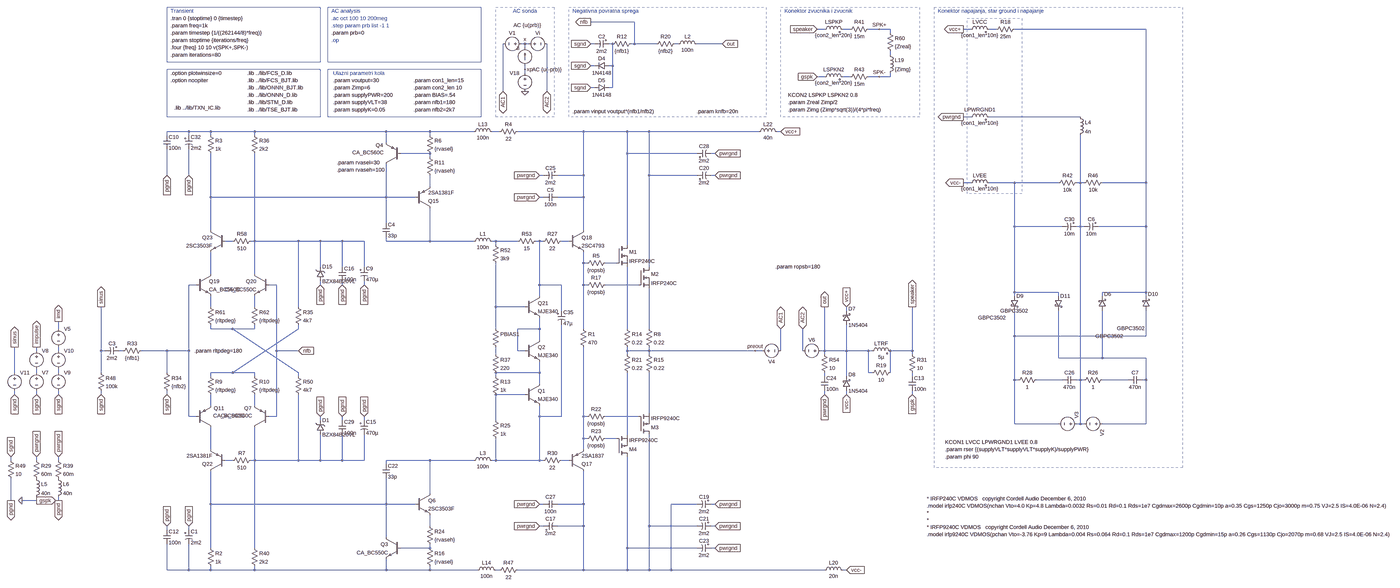
[diagram p0: schematic pab3bbb-impulse.asc, whole sheet]
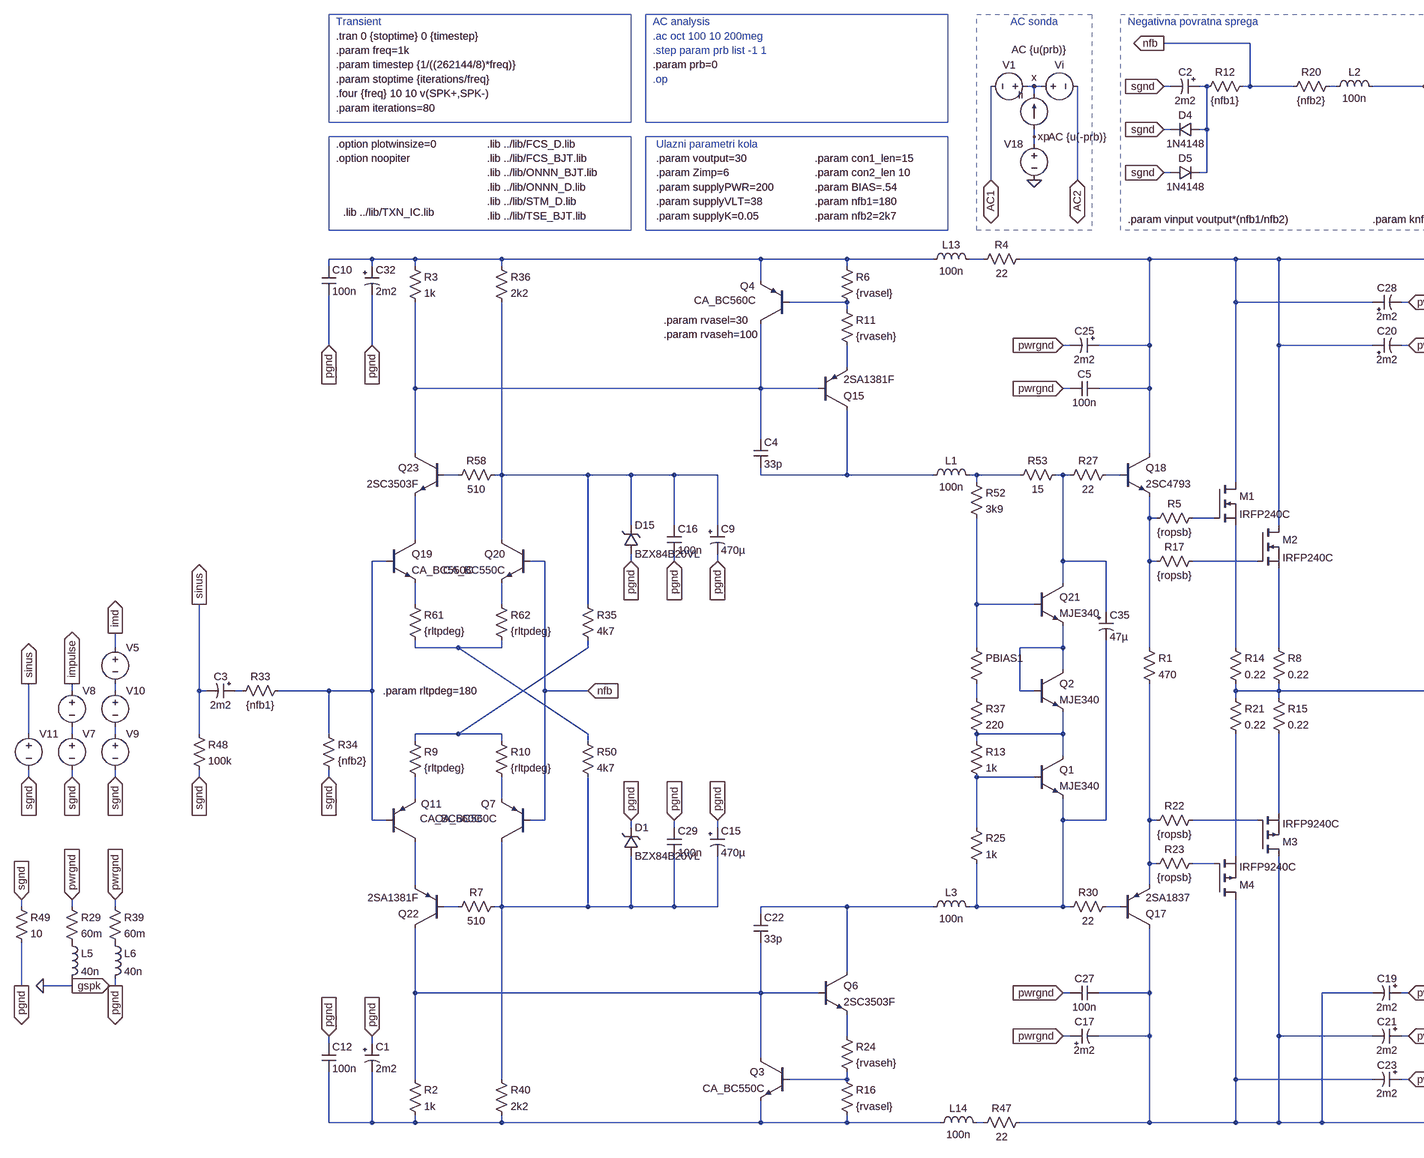
[diagram p1: schematic pab3bbb-impulse.asc, part, row 1 of 1, column 1 of 2]
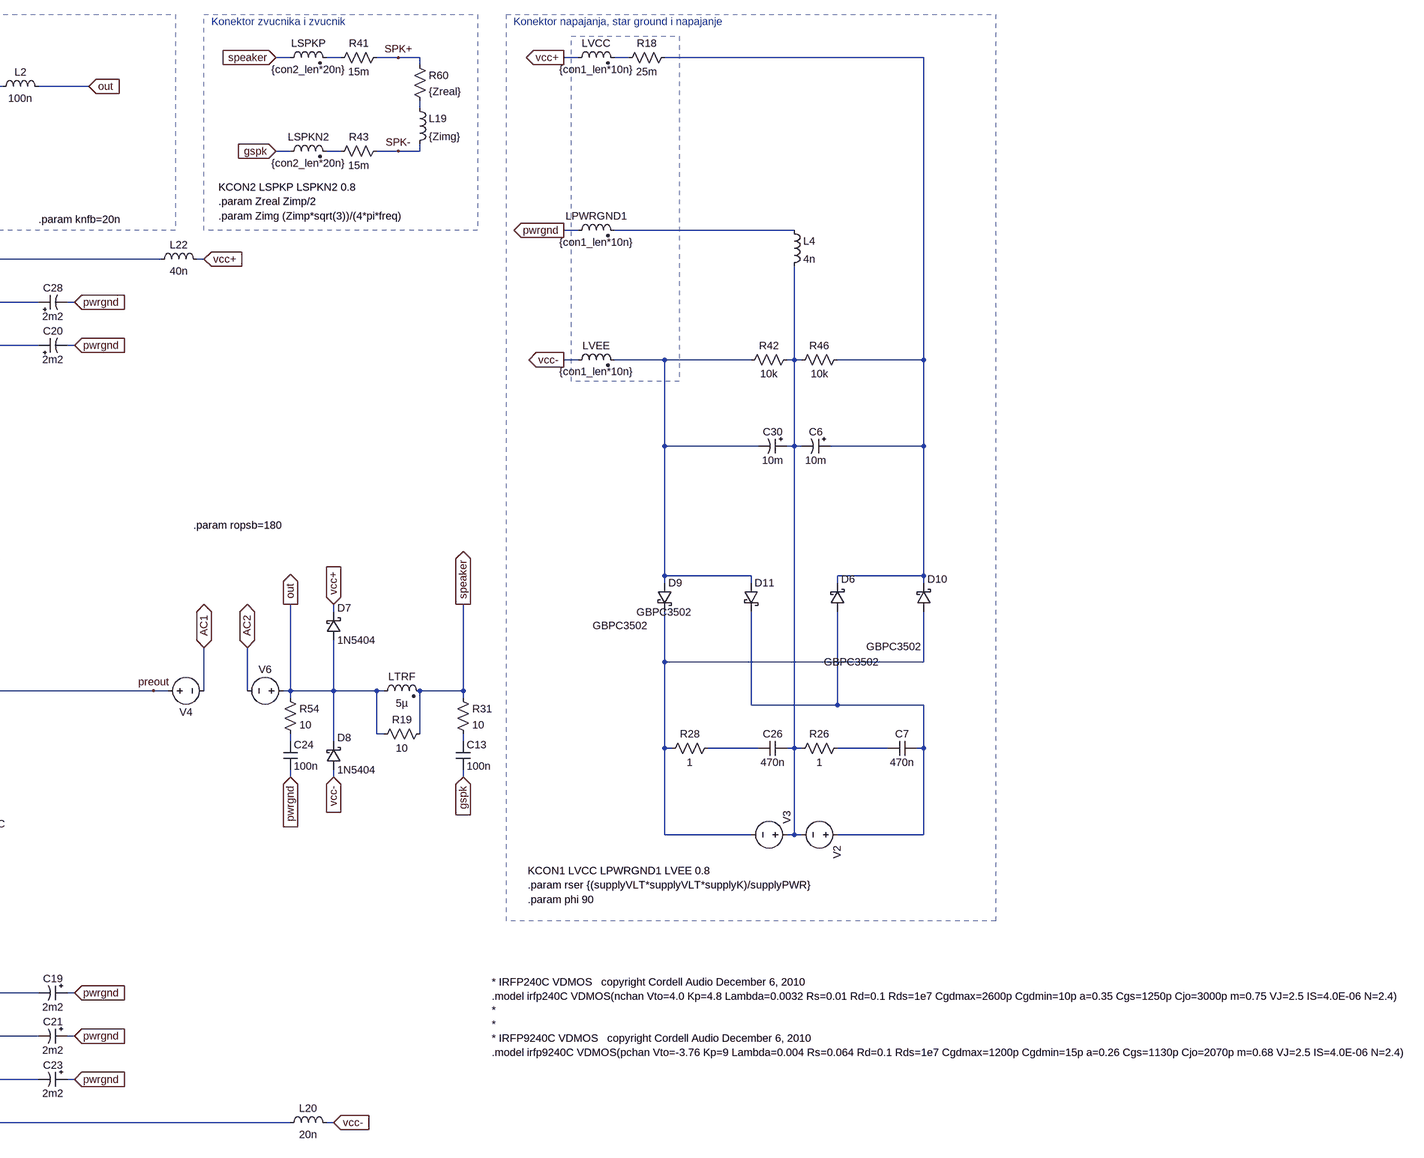
[diagram p2: schematic pab3bbb-impulse.asc, part, row 1 of 1, column 2 of 2]
pab3bbb-impulse.asc, the LTspice schematic file:
Version 4
SHEET 1 6124 2336
WIRE 1472 -1568 1280 -1568
WIRE 2304 -1536 2272 -1536
WIRE 2416 -1536 2384 -1536
WIRE 2544 -1536 2496 -1536
WIRE 2592 -1536 2544 -1536
WIRE 2944 -1536 2912 -1536
WIRE 3056 -1536 3024 -1536
WIRE 3712 -1536 3136 -1536
WIRE 2592 -1520 2592 -1536
WIRE 992 -1472 976 -1472
WIRE 1008 -1472 992 -1472
WIRE 1296 -1472 1280 -1472
WIRE 1376 -1472 1360 -1472
WIRE 1472 -1472 1472 -1568
WIRE 1472 -1472 1456 -1472
WIRE 1568 -1472 1472 -1472
WIRE 1664 -1472 1648 -1472
WIRE 1856 -1472 1744 -1472
WIRE 992 -1456 992 -1472
WIRE 2592 -1424 2592 -1440
WIRE 1296 -1376 1280 -1376
WIRE 1376 -1376 1376 -1472
WIRE 1376 -1376 1360 -1376
WIRE 992 -1360 992 -1376
WIRE 992 -1344 992 -1360
WIRE 2304 -1328 2272 -1328
WIRE 2416 -1328 2384 -1328
WIRE 2544 -1328 2496 -1328
WIRE 2592 -1328 2592 -1344
WIRE 2592 -1328 2544 -1328
WIRE 1296 -1280 1280 -1280
WIRE 1376 -1280 1376 -1376
WIRE 1376 -1280 1360 -1280
WIRE 896 -1264 896 -1472
WIRE 1088 -1264 1088 -1472
WIRE 2944 -1152 2912 -1152
WIRE 3424 -1152 3024 -1152
WIRE -480 -1088 -576 -1088
WIRE -384 -1088 -480 -1088
WIRE -192 -1088 -384 -1088
WIRE 384 -1088 -192 -1088
WIRE 576 -1088 384 -1088
WIRE 768 -1088 576 -1088
WIRE 880 -1088 848 -1088
WIRE 1248 -1088 960 -1088
WIRE 1440 -1088 1248 -1088
WIRE 1536 -1088 1440 -1088
WIRE 2016 -1088 1536 -1088
WIRE 2112 -1088 2096 -1088
WIRE -576 -1072 -576 -1088
WIRE -480 -1072 -480 -1088
WIRE -384 -1072 -384 -1088
WIRE -192 -1072 -192 -1088
WIRE 576 -1072 576 -1088
WIRE 384 -1040 384 -1088
WIRE 576 -992 448 -992
WIRE 1440 -992 1440 -1088
WIRE 1744 -992 1440 -992
WIRE 1824 -992 1808 -992
WIRE 576 -976 576 -992
WIRE -576 -896 -576 -1008
WIRE -480 -896 -480 -1008
WIRE 1072 -896 1056 -896
WIRE 1248 -896 1248 -1088
WIRE 1248 -896 1136 -896
WIRE 1536 -896 1536 -1088
WIRE 1744 -896 1536 -896
WIRE 1824 -896 1808 -896
WIRE 2944 -864 2912 -864
WIRE 3136 -864 3024 -864
WIRE 3328 -864 3136 -864
WIRE 3424 -864 3424 -1072
WIRE 3424 -864 3408 -864
WIRE 3440 -864 3424 -864
WIRE 3712 -864 3712 -1536
WIRE 3712 -864 3520 -864
WIRE 576 -848 576 -896
WIRE -384 -800 -384 -992
WIRE 384 -800 384 -944
WIRE 384 -800 -384 -800
WIRE 512 -800 384 -800
WIRE 1072 -800 1056 -800
WIRE 1248 -800 1248 -896
WIRE 1248 -800 1136 -800
WIRE 384 -688 384 -800
WIRE 3136 -672 3136 -864
WIRE 3344 -672 3136 -672
WIRE 3424 -672 3424 -864
WIRE 3424 -672 3408 -672
WIRE 3440 -672 3424 -672
WIRE 3712 -672 3712 -864
WIRE 3712 -672 3504 -672
WIRE -384 -656 -384 -800
WIRE 1248 -656 1248 -800
WIRE -288 -608 -320 -608
WIRE -192 -608 -192 -992
WIRE -192 -608 -208 -608
WIRE 0 -608 -192 -608
WIRE 96 -608 0 -608
WIRE 192 -608 96 -608
WIRE 288 -608 192 -608
WIRE 384 -608 384 -624
WIRE 576 -608 576 -752
WIRE 576 -608 384 -608
WIRE 768 -608 576 -608
WIRE 864 -608 848 -608
WIRE 960 -608 864 -608
WIRE 1056 -608 1040 -608
WIRE 1072 -608 1056 -608
WIRE 1184 -608 1152 -608
WIRE 864 -592 864 -608
WIRE 1440 -592 1440 -992
WIRE 1248 -512 1248 -560
WIRE 1264 -512 1248 -512
WIRE 1392 -512 1344 -512
WIRE 96 -496 96 -608
WIRE 192 -496 192 -608
WIRE 288 -496 288 -608
WIRE 1536 -496 1536 -896
WIRE -384 -464 -384 -560
WIRE -192 -464 -192 -608
WIRE -448 -416 -480 -416
WIRE -96 -416 -128 -416
WIRE 96 -416 96 -432
WIRE 192 -416 192 -432
WIRE 288 -416 288 -432
WIRE 1056 -416 1056 -608
WIRE 1152 -416 1056 -416
WIRE 1248 -416 1248 -512
WIRE 1264 -416 1248 -416
WIRE 1488 -416 1344 -416
WIRE 3136 -384 3136 -672
WIRE 3328 -384 3136 -384
WIRE 3712 -384 3712 -672
WIRE 3712 -384 3520 -384
WIRE 1056 -368 1056 -416
WIRE 3136 -368 3136 -384
WIRE 3328 -368 3328 -384
WIRE 3520 -368 3520 -384
WIRE 3712 -368 3712 -384
WIRE -384 -320 -384 -368
WIRE -192 -320 -192 -368
WIRE 0 -320 0 -608
WIRE 864 -320 864 -512
WIRE 992 -320 864 -320
WIRE 1152 -304 1152 -416
WIRE 2400 -304 2400 -320
WIRE -1056 -224 -1056 -256
WIRE -384 -224 -384 -240
WIRE -288 -224 -384 -224
WIRE -192 -224 -192 -240
WIRE -192 -224 -288 -224
WIRE 0 -224 0 -240
WIRE 864 -224 864 -320
WIRE 1056 -224 1056 -272
WIRE 1056 -224 960 -224
WIRE 1248 -224 1248 -416
WIRE 1440 -224 1440 -496
WIRE 1536 -224 1536 -400
WIRE 3136 -192 3136 -304
WIRE 3712 -192 3712 -304
WIRE 3712 -192 3136 -192
WIRE 1056 -176 1056 -224
WIRE -1152 -128 -1152 -144
WIRE -1056 -128 -1056 -144
WIRE -864 -128 -864 -320
WIRE -848 -128 -864 -128
WIRE -768 -128 -784 -128
WIRE -576 -128 -688 -128
WIRE -480 -128 -480 -416
WIRE -480 -128 -576 -128
WIRE -96 -128 -96 -416
WIRE 0 -128 -96 -128
WIRE 960 -128 960 -224
WIRE 992 -128 960 -128
WIRE 1440 -128 1440 -144
WIRE 1536 -128 1536 -144
WIRE 1536 -128 1440 -128
WIRE 2000 -128 1536 -128
WIRE 2032 -128 2000 -128
WIRE 2112 -128 2112 -224
WIRE 2208 -128 2208 -224
WIRE 2304 -128 2304 -320
WIRE 2304 -128 2288 -128
WIRE 2400 -128 2400 -240
WIRE 2400 -128 2304 -128
WIRE 2496 -128 2400 -128
WIRE 2512 -128 2496 -128
WIRE 2688 -128 2688 -320
WIRE 2688 -128 2592 -128
WIRE 864 -112 864 -144
WIRE 1440 -112 1440 -128
WIRE 1536 -112 1536 -128
WIRE 2304 -112 2304 -128
WIRE 2688 -112 2688 -128
WIRE 3328 -96 3328 -304
WIRE 3520 -96 3520 -304
WIRE 3520 -96 3328 -96
WIRE 3712 -96 3520 -96
WIRE -1248 -32 -1248 -144
WIRE -1152 -32 -1152 -48
WIRE -1056 -32 -1056 -48
WIRE -864 -32 -864 -128
WIRE -576 -32 -576 -128
WIRE -288 -32 0 -224
WIRE -288 -32 -384 -32
WIRE -192 -32 -288 -32
WIRE 0 -32 -288 -224
WIRE 1056 -32 1056 -80
WIRE 1056 -32 864 -32
WIRE 2496 -32 2496 -128
WIRE 2512 -32 2496 -32
WIRE 2592 -32 2592 -128
WIRE -384 -16 -384 -32
WIRE -192 -16 -192 -32
WIRE 0 -16 0 -32
WIRE 864 -16 864 -32
WIRE 2304 -16 2304 -32
WIRE 2400 -16 2400 -128
WIRE 2688 -16 2688 -32
WIRE 3136 0 3136 -192
WIRE 3152 0 3136 0
WIRE 3344 0 3232 0
WIRE 3424 0 3424 -672
WIRE 3424 0 3408 0
WIRE 3440 0 3424 0
WIRE 3632 0 3520 0
WIRE 3712 0 3712 -96
WIRE 3712 0 3696 0
WIRE 1056 16 1056 -32
WIRE -1248 64 -1248 48
WIRE -1152 64 -1152 48
WIRE -1056 64 -1056 48
WIRE -864 64 -864 48
WIRE -576 64 -576 48
WIRE 992 64 864 64
WIRE 2304 64 2304 48
WIRE 2400 64 2400 48
WIRE 2688 64 2688 48
WIRE -384 112 -384 64
WIRE -192 112 -192 64
WIRE 1536 144 1536 -32
WIRE -480 160 -480 -128
WIRE -448 160 -480 160
WIRE -96 160 -96 -128
WIRE -96 160 -128 160
WIRE 1056 160 1056 112
WIRE 1152 160 1152 -240
WIRE 1152 160 1056 160
WIRE 1248 160 1248 -144
WIRE 1264 160 1248 160
WIRE 1488 160 1344 160
WIRE 96 176 96 160
WIRE 192 176 192 160
WIRE 288 176 288 160
WIRE 864 176 864 64
WIRE 3136 192 3136 0
WIRE 3328 192 3136 192
WIRE 3424 192 3424 0
WIRE 3424 192 3408 192
WIRE 3440 192 3424 192
WIRE 3712 192 3712 0
WIRE 3712 192 3520 192
WIRE 1440 240 1440 -32
WIRE 1248 256 1248 160
WIRE 1264 256 1248 256
WIRE 1392 256 1344 256
WIRE -384 304 -384 208
WIRE 1248 304 1248 256
WIRE -1264 352 -1264 336
WIRE -1152 352 -1152 336
WIRE -1056 352 -1056 336
WIRE -288 352 -320 352
WIRE -192 352 -192 208
WIRE -192 352 -208 352
WIRE 0 352 0 64
WIRE 0 352 -192 352
WIRE 96 352 96 240
WIRE 96 352 0 352
WIRE 192 352 192 240
WIRE 192 352 96 352
WIRE 288 352 288 240
WIRE 288 352 192 352
WIRE 576 352 384 352
WIRE 768 352 576 352
WIRE 864 352 864 256
WIRE 864 352 848 352
WIRE 1056 352 1056 160
WIRE 1056 352 864 352
WIRE 1072 352 1056 352
WIRE 1184 352 1152 352
WIRE 384 368 384 352
WIRE 576 496 576 352
WIRE -1264 528 -1264 432
WIRE -1152 528 -1152 512
WIRE -1152 528 -1216 528
WIRE -1056 528 -1056 512
WIRE -384 544 -384 400
WIRE 384 544 384 432
WIRE 384 544 -384 544
WIRE 512 544 384 544
WIRE 1072 544 1056 544
WIRE 1248 544 1248 400
WIRE 1248 544 1136 544
WIRE 1744 544 1632 544
WIRE 1824 544 1808 544
WIRE 576 640 576 592
WIRE 1072 640 1056 640
WIRE 1248 640 1248 544
WIRE 1248 640 1136 640
WIRE 1536 640 1536 240
WIRE 1744 640 1536 640
WIRE 1824 640 1808 640
WIRE -576 656 -576 640
WIRE -480 656 -480 640
WIRE 384 688 384 544
WIRE -384 736 -384 544
WIRE -192 736 -192 352
WIRE 576 736 576 720
WIRE 576 736 448 736
WIRE 1440 736 1440 336
WIRE 1744 736 1440 736
WIRE 1824 736 1808 736
WIRE -576 832 -576 720
WIRE -480 832 -480 720
WIRE -480 832 -576 832
WIRE -384 832 -384 816
WIRE -384 832 -480 832
WIRE -192 832 -192 816
WIRE -192 832 -384 832
WIRE 384 832 384 784
WIRE 384 832 -192 832
WIRE 576 832 576 816
WIRE 576 832 384 832
WIRE 784 832 576 832
WIRE 880 832 864 832
WIRE 1248 832 1248 640
WIRE 1248 832 960 832
WIRE 1440 832 1440 736
WIRE 1440 832 1248 832
WIRE 1536 832 1536 640
WIRE 1536 832 1440 832
WIRE 1632 832 1632 544
WIRE 1632 832 1536 832
WIRE 2304 832 1632 832
WIRE 2400 832 2384 832
FLAG 2112 -1088 vcc+
IOPIN 2112 -1088 In
FLAG 992 -1472 x
FLAG 2400 832 vcc-
IOPIN 2400 832 In
FLAG 2304 -320 out
IOPIN 2304 -320 Out
FLAG 1280 -1568 nfb
IOPIN 1280 -1568 Out
FLAG 0 -128 nfb
IOPIN 0 -128 In
FLAG 992 -1360 xp
FLAG 2304 64 pwrgnd
IOPIN 2304 64 In
FLAG -576 64 sgnd
IOPIN -576 64 In
FLAG 1280 -1472 sgnd
IOPIN 1280 -1472 In
FLAG -1248 64 sgnd
IOPIN -1248 64 In
FLAG -1248 -144 sinus
IOPIN -1248 -144 Out
FLAG 2912 -1536 vcc+
IOPIN 2912 -1536 Out
FLAG 2912 -864 vcc-
IOPIN 2912 -864 Out
FLAG 1856 -1472 out
IOPIN 1856 -1472 In
FLAG 2688 -320 speaker
IOPIN 2688 -320 Out
FLAG 2272 -1536 speaker
IOPIN 2272 -1536 In
FLAG 2912 -1152 pwrgnd
IOPIN 2912 -1152 Out
FLAG -1152 -144 impulse
IOPIN -1152 -144 Out
FLAG 896 -1264 AC1
IOPIN 896 -1264 BiDir
FLAG 1088 -1264 AC2
IOPIN 1088 -1264 BiDir
FLAG 2112 -224 AC1
IOPIN 2112 -224 BiDir
FLAG 2208 -224 AC2
IOPIN 2208 -224 BiDir
FLAG 2544 -1536 SPK+
FLAG 2544 -1328 SPK-
FLAG -1056 -256 imd
IOPIN -1056 -256 Out
FLAG 2400 -320 vcc+
IOPIN 2400 -320 In
FLAG 2400 64 vcc-
IOPIN 2400 64 In
FLAG -1152 64 sgnd
IOPIN -1152 64 In
FLAG -1056 64 sgnd
IOPIN -1056 64 In
FLAG 1056 640 pwrgnd
IOPIN 1056 640 In
FLAG -864 64 sgnd
IOPIN -864 64 In
FLAG -1264 336 sgnd
IOPIN -1264 336 In
FLAG 2000 -128 preout
FLAG 1280 -1376 sgnd
IOPIN 1280 -1376 In
FLAG 1280 -1280 sgnd
IOPIN 1280 -1280 In
FLAG 1056 -800 pwrgnd
IOPIN 1056 -800 In
FLAG 1056 544 pwrgnd
IOPIN 1056 544 In
FLAG -480 640 pgnd
IOPIN -480 640 In
FLAG -576 640 pgnd
IOPIN -576 640 In
FLAG 2688 64 gspk
IOPIN 2688 64 In
FLAG -1056 528 pgnd
IOPIN -1056 528 Out
FLAG -1056 336 pwrgnd
IOPIN -1056 336 In
FLAG 2272 -1328 gspk
IOPIN 2272 -1328 In
FLAG -1152 528 gspk
IOPIN -1152 528 Out
FLAG -1152 336 pwrgnd
IOPIN -1152 336 In
FLAG -1264 528 pgnd
IOPIN -1264 528 Out
FLAG 96 160 pgnd
IOPIN 96 160 In
FLAG 288 160 pgnd
IOPIN 288 160 In
FLAG 1824 544 pwrgnd
IOPIN 1824 544 In
FLAG 1824 640 pwrgnd
IOPIN 1824 640 In
FLAG 1824 736 pwrgnd
IOPIN 1824 736 In
FLAG 1056 -896 pwrgnd
IOPIN 1056 -896 In
FLAG 1824 -896 pwrgnd
IOPIN 1824 -896 In
FLAG 1824 -992 pwrgnd
IOPIN 1824 -992 In
FLAG 96 -416 pgnd
IOPIN 96 -416 In
FLAG 288 -416 pgnd
IOPIN 288 -416 In
FLAG -480 -896 pgnd
IOPIN -480 -896 In
FLAG -576 -896 pgnd
IOPIN -576 -896 In
FLAG 992 -1264 0
FLAG -1216 528 0
FLAG 192 -416 pgnd
IOPIN 192 -416 In
FLAG 192 160 pgnd
IOPIN 192 160 In
FLAG -864 -320 sinus
IOPIN -864 -320 Out
DATAFLAG 1344 -1088 ""
DATAFLAG 1344 832 ""
DATAFLAG 1248 -992 "Ic(Q18)"
DATAFLAG 1824 -128 ""
DATAFLAG 1440 -896 "Id(M1)"
SYMBOL res 1472 -1488 R90
WINDOW 0 0 56 VBottom 2
WINDOW 3 32 56 VTop 2
SYMATTR InstName R12
SYMATTR Value {nfb1}
SYMBOL voltage 3536 192 R90
WINDOW 123 0 0 Left 2
WINDOW 3 -94 177 Invisible 2
SYMATTR Value SINE(0 {supplyVLT*sqrt(2)} 50 1m 0 {phi})
SYMATTR SpiceLine Rser={rser}
SYMATTR InstName V2
SYMBOL current 992 -1376 R180
WINDOW 0 24 77 Left 2
WINDOW 3 24 0 Invisible 2
WINDOW 123 -71 178 Left 2
WINDOW 39 0 0 Left 2
SYMATTR InstName Ii
SYMATTR Value 0
SYMATTR Value2 AC {u(prb)}
SYMBOL voltage 992 -1472 R270
WINDOW 0 32 56 VTop 2
WINDOW 3 -32 56 Invisible 2
WINDOW 123 -97 96 VBottom 2
WINDOW 39 -32 56 VBottom 2
SYMATTR InstName Vi
SYMATTR Value 0
SYMATTR Value2 AC {u(-prb)}
SYMBOL pnp -448 208 M180
WINDOW 0 77 84 Left 2
WINDOW 3 75 52 Left 2
SYMATTR InstName Q11
SYMATTR Value CA_BC560C
SYMBOL res -784 -112 R270
WINDOW 0 32 56 VTop 2
WINDOW 3 0 56 VBottom 2
SYMATTR InstName R33
SYMATTR Value {nfb1}
SYMBOL res -592 -48 R0
SYMATTR InstName R34
SYMATTR Value {nfb2}
SYMBOL res -400 -32 R0
SYMATTR InstName R9
SYMATTR Value {rltpdeg}
SYMBOL schottky 2384 -240 M180
WINDOW 0 24 72 Left 2
WINDOW 3 24 0 Left 2
SYMATTR InstName D7
SYMATTR Value 1N5404
SYMATTR Description Diode
SYMATTR Type diode
SYMBOL schottky 2384 48 M180
WINDOW 0 24 72 Left 2
WINDOW 3 24 0 Left 2
SYMATTR InstName D8
SYMATTR Value 1N5404
SYMATTR Description Diode
SYMATTR Type diode
SYMBOL ind2 2496 -112 R270
WINDOW 0 32 56 VTop 2
WINDOW 3 4 56 VBottom 2
SYMATTR InstName LTRF
SYMATTR Value 5µ
SYMATTR SpiceLine Rser=50m Rpar=3meg Cpar=1p
SYMATTR Type ind
SYMBOL res 2496 -16 R270
WINDOW 0 32 56 VTop 2
WINDOW 3 0 56 VBottom 2
SYMATTR InstName R19
SYMATTR Value 10
SYMBOL res 1664 -1488 R90
WINDOW 0 0 56 VBottom 2
WINDOW 3 32 56 VTop 2
SYMATTR InstName R20
SYMATTR Value {nfb2}
SYMBOL voltage 992 -1472 R90
WINDOW 0 -32 56 VBottom 2
WINDOW 3 32 56 Invisible 2
WINDOW 123 0 0 Left 2
WINDOW 39 0 0 Left 2
SYMATTR InstName V1
SYMATTR Value 0
SYMBOL schottky 3504 -304 M180
WINDOW 0 24 72 Left 2
WINDOW 3 -14 -112 Left 2
SYMATTR InstName D6
SYMATTR Value GBPC3502
SYMATTR Description Diode
SYMATTR Type diode
SYMBOL schottky 3120 -368 R0
WINDOW 3 -144 95 Left 2
SYMATTR Value GBPC3502
SYMATTR InstName D9
SYMATTR Description Diode
SYMATTR Type diode
SYMBOL voltage 3424 192 M270
WINDOW 123 0 0 Left 2
WINDOW 3 -96 -62 Invisible 2
SYMATTR Value SINE(0 {supplyVLT*sqrt(2)} 50 1m 0 {phi})
SYMATTR SpiceLine Rser={rser}
SYMATTR InstName V3
SYMBOL res 2288 -128 R0
SYMATTR InstName R54
SYMATTR Value 10
SYMBOL res 2576 -1536 R0
SYMATTR InstName R60
SYMATTR Value {Zreal}
SYMBOL ind 2576 -1440 R0
SYMATTR InstName L19
SYMATTR Value {Zimg}
SYMATTR SpiceLine Cpar=10p
SYMBOL voltage 992 -1360 M0
WINDOW 123 0 0 Left 2
WINDOW 39 0 0 Left 2
WINDOW 3 24 96 Invisible 2
SYMATTR Value 0
SYMATTR InstName V18
SYMBOL pnp 1184 400 M180
SYMATTR InstName Q17
SYMATTR Value 2SA1837
SYMBOL npn 1184 -656 R0
SYMATTR InstName Q18
SYMATTR Value 2SC4793
SYMBOL res 1168 -624 R90
WINDOW 0 0 56 VBottom 2
WINDOW 3 32 56 VTop 2
SYMATTR InstName R27
SYMATTR Value 22
SYMBOL res 1168 336 R90
WINDOW 0 0 56 VBottom 2
WINDOW 3 32 56 VTop 2
SYMATTR InstName R30
SYMATTR Value 22
SYMBOL cap 2288 -16 R0
SYMATTR InstName C24
SYMATTR Value 100n
SYMATTR SpiceLine Rser=700m Lser=7n Rpar=4.4meg Cpar=1p
SYMBOL res 848 -240 R0
WINDOW 3 36 76 Invisible 2
SYMATTR Value {1+(1000*BIAS)}
SYMATTR InstName PBIAS1
SYMBOL res 848 -608 R0
SYMATTR InstName R52
SYMATTR Value 3k9
SYMBOL res 1056 -624 R90
WINDOW 0 0 56 VBottom 2
WINDOW 3 32 56 VTop 2
SYMATTR InstName R53
SYMATTR Value 15
SYMBOL schottky 3696 -304 M180
WINDOW 0 24 72 Left 2
WINDOW 3 -112 -78 Left 2
SYMATTR InstName D10
SYMATTR Value GBPC3502
SYMATTR Description Diode
SYMATTR Type diode
SYMBOL schottky 3312 -368 R0
WINDOW 3 -239 65 Left 2
SYMATTR Value GBPC3502
SYMATTR InstName D11
SYMATTR Description Diode
SYMATTR Type diode
SYMBOL ind2 2928 -1520 R270
WINDOW 0 32 56 VTop 2
WINDOW 3 5 56 VBottom 2
SYMATTR InstName LVCC
SYMATTR Value {con1_len*10n}
SYMATTR SpiceLine Rser={con1_len*1m + 25m}
SYMATTR Type ind
SYMBOL ind2 2928 -848 R270
WINDOW 0 32 56 VTop 2
WINDOW 3 5 56 VBottom 2
SYMATTR InstName LVEE
SYMATTR Value {con1_len*10n}
SYMATTR SpiceLine Rser={con1_len*1m + 25m}
SYMATTR Type ind
SYMBOL voltage -1248 -48 R0
WINDOW 123 24 44 Left 2
WINDOW 39 0 0 Left 2
WINDOW 3 24 96 Invisible 2
SYMATTR Value SINE(0 {vinput} {freq})
SYMATTR InstName V11
SYMBOL res 1232 -240 R0
SYMATTR InstName R1
SYMATTR Value 470
SYMBOL pnp -128 208 R180
WINDOW 0 77 84 Left 2
WINDOW 3 75 52 Left 2
SYMATTR InstName Q7
SYMATTR Value CA_BC560C
SYMBOL npn 992 -368 R0
SYMATTR InstName Q21
SYMATTR Value MJE340
SYMBOL res 3152 -1552 R90
WINDOW 0 0 56 VBottom 2
WINDOW 3 32 56 VTop 2
SYMATTR InstName R18
SYMATTR Value 25m
SYMBOL ind 3408 -1168 R0
SYMATTR InstName L4
SYMATTR Value 4n
SYMATTR SpiceLine Rser=1m
SYMBOL ind2 2288 -1520 R270
WINDOW 0 32 56 VTop 2
WINDOW 3 5 56 VBottom 2
SYMATTR InstName LSPKP
SYMATTR Value {con2_len*20n}
SYMATTR SpiceLine Rser={con2_len*.5m}
SYMATTR Type ind
SYMBOL ind2 2288 -1312 R270
WINDOW 0 32 56 VTop 2
WINDOW 3 5 56 VBottom 2
SYMATTR InstName LSPKN2
SYMATTR Value {con2_len*20n}
SYMATTR SpiceLine Rser={con2_len*.5m}
SYMATTR Type ind
SYMBOL res 2512 -1552 R90
WINDOW 0 0 56 VBottom 2
WINDOW 3 32 56 VTop 2
SYMATTR InstName R41
SYMATTR Value 15m
SYMBOL res 2512 -1344 R90
WINDOW 0 0 56 VBottom 2
WINDOW 3 32 56 VTop 2
SYMATTR InstName R43
SYMATTR Value 15m
SYMBOL ind2 2928 -1136 R270
WINDOW 0 32 56 VTop 2
WINDOW 3 5 56 VBottom 2
SYMATTR InstName LPWRGND1
SYMATTR Value {con1_len*10n}
SYMATTR SpiceLine Rser={con1_len*1m + 25m}
SYMATTR Type ind
SYMBOL voltage -1152 -48 R0
WINDOW 3 24 96 Invisible 2
WINDOW 123 0 0 Left 2
WINDOW 39 0 0 Left 2
SYMATTR Value PULSE(0 {vinput/2} 1u 1n 1n {1/(freq*2)} {1/freq})
SYMATTR InstName V7
SYMBOL voltage -1152 -144 R0
WINDOW 3 24 96 Invisible 2
WINDOW 123 0 0 Left 2
WINDOW 39 0 0 Left 2
SYMATTR Value PULSE(0 {-vinput/2} {1u+(1/(freq*2))} 1n 1n {1/(freq*2)} {1/freq})
SYMATTR InstName V8
SYMBOL polcap 1072 656 R270
WINDOW 0 32 32 VTop 2
WINDOW 3 0 32 VBottom 2
SYMATTR InstName C17
SYMATTR Value 2m2
SYMATTR SpiceLine V=63 Irms=2.77 Rser=0.136 Lser=14n Rpar=900k Cpar=3p
SYMATTR Description Capacitor
SYMATTR Type cap
SYMBOL res 848 -128 R0
SYMATTR InstName R37
SYMATTR Value 220
SYMBOL voltage 2016 -128 R270
WINDOW 0 -32 56 VBottom 2
WINDOW 3 32 56 Invisible 2
WINDOW 123 0 0 Left 2
WINDOW 39 0 0 Left 2
SYMATTR InstName V4
SYMATTR Value 0
SYMBOL voltage 2304 -128 R90
WINDOW 0 -32 56 VBottom 2
WINDOW 3 32 56 Invisible 2
WINDOW 123 0 0 Left 2
WINDOW 39 0 0 Left 2
SYMATTR InstName V6
SYMATTR Value 0
SYMBOL voltage -1056 -48 R0
WINDOW 3 24 96 Invisible 2
WINDOW 123 0 0 Left 2
WINDOW 39 0 0 Left 2
SYMATTR Value SINE(0 {vinput/3} 19k)
SYMATTR InstName V9
SYMBOL voltage -1056 -144 R0
WINDOW 3 24 96 Invisible 2
WINDOW 123 0 0 Left 2
WINDOW 39 0 0 Left 2
SYMATTR Value SINE(0 {vinput/3} 20k 0 0)
SYMATTR InstName V10
SYMBOL res 1360 -528 R90
WINDOW 0 0 56 VBottom 2
WINDOW 3 32 56 VTop 2
SYMATTR InstName R5
SYMATTR Value {ropsb}
SYMBOL res 1424 -240 R0
SYMATTR InstName R14
SYMATTR Value 0.22
SYMBOL res 1424 -128 R0
SYMATTR InstName R21
SYMATTR Value 0.22
SYMBOL cap 3344 -16 M90
WINDOW 0 0 32 VBottom 2
WINDOW 3 32 32 VTop 2
SYMATTR InstName C26
SYMATTR Value 470n
SYMATTR SpiceLine Rser=70m Lser=17n Rpar=4.4meg Cpar=1p
SYMBOL polcap 3408 -688 R90
WINDOW 0 0 32 VBottom 2
WINDOW 3 32 32 VTop 2
SYMATTR InstName C30
SYMATTR Value 10m
SYMATTR SpiceLine V=63 Irms=2.5 Rser=0.08 Lser=20n Rpar=40k Cpar=3p
SYMATTR Description Capacitor
SYMATTR Type cap
SYMBOL polcap 3504 -688 R90
WINDOW 0 0 32 VBottom 2
WINDOW 3 32 32 VTop 2
SYMATTR InstName C6
SYMATTR Value 10m
SYMATTR SpiceLine V=50 Irms=2.5 Rser=0.08 Lser=20n Rpar=40k Cpar=3p
SYMATTR Description Capacitor
SYMATTR Type cap
SYMBOL res 3424 -880 R90
WINDOW 0 0 56 VBottom 2
WINDOW 3 32 56 VTop 2
SYMATTR InstName R42
SYMATTR Value 10k
SYMBOL res 3536 -880 R90
WINDOW 0 0 56 VBottom 2
WINDOW 3 32 56 VTop 2
SYMATTR InstName R46
SYMATTR Value 10k
SYMBOL polcap -496 -1072 R0
SYMATTR InstName C32
SYMATTR Value 2m2
SYMATTR SpiceLine V=63 Irms=2.77 Rser=0.106 Lser=14n Rpar=900k Cpar=3p
SYMATTR Description Capacitor
SYMATTR Type cap
SYMBOL res -880 -48 R0
SYMATTR InstName R48
SYMATTR Value 100k
SYMBOL res -1280 336 R0
SYMATTR InstName R49
SYMATTR Value 10
SYMBOL diode 1360 -1392 R90
WINDOW 0 0 32 VBottom 2
WINDOW 3 32 32 VTop 2
SYMATTR InstName D4
SYMATTR Value 1N4148
SYMBOL diode 1296 -1264 R270
WINDOW 0 32 32 VTop 2
WINDOW 3 0 32 VBottom 2
SYMATTR InstName D5
SYMATTR Value 1N4148
SYMBOL res 1520 -240 R0
SYMATTR InstName R8
SYMATTR Value 0.22
SYMBOL res 1520 -128 R0
SYMATTR InstName R15
SYMATTR Value 0.22
SYMBOL pnp 512 -752 M180
SYMATTR InstName Q15
SYMATTR Value 2SA1381F
SYMBOL cap 1136 -816 R90
WINDOW 0 0 32 VBottom 2
WINDOW 3 32 32 VTop 2
SYMATTR InstName C5
SYMATTR Value 100n
SYMATTR SpiceLine Rser=700m Lser=7n Rpar=4.4meg Cpar=1p
SYMBOL cap 1136 560 M270
WINDOW 0 32 32 VTop 2
WINDOW 3 0 32 VBottom 2
SYMATTR InstName C27
SYMATTR Value 100n
SYMATTR SpiceLine Rser=700m Lser=7n Rpar=4.4meg Cpar=1p
SYMBOL res 3248 -16 R90
WINDOW 0 0 56 VBottom 2
WINDOW 3 32 56 VTop 2
SYMATTR InstName R28
SYMATTR Value 1
SYMBOL cap 3632 -16 M90
WINDOW 0 0 32 VBottom 2
WINDOW 3 32 32 VTop 2
SYMATTR InstName C7
SYMATTR Value 470n
SYMATTR SpiceLine Rser=70m Lser=17n Rpar=4.4meg Cpar=1p
SYMBOL res 3536 -16 R90
WINDOW 0 0 56 VBottom 2
WINDOW 3 32 56 VTop 2
SYMATTR InstName R26
SYMATTR Value 1
SYMBOL cap -592 720 M180
WINDOW 0 24 56 Left 2
WINDOW 3 24 8 Left 2
SYMATTR InstName C12
SYMATTR Value 100n
SYMATTR SpiceLine Rser=700m Lser=7n Rpar=4.4meg Cpar=1p
SYMBOL res 2672 -128 R0
SYMATTR InstName R31
SYMATTR Value 10
SYMBOL cap 2672 -16 R0
SYMATTR InstName C13
SYMATTR Value 100n
SYMATTR SpiceLine Rser=700m Lser=7n Rpar=4.4meg Cpar=1p
SYMBOL res 1360 -432 R90
WINDOW 0 0 56 VBottom 2
WINDOW 3 32 56 VTop 2
SYMATTR InstName R17
SYMATTR Value {ropsb}
SYMBOL res 1360 144 R90
WINDOW 0 0 56 VBottom 2
WINDOW 3 32 56 VTop 2
SYMATTR InstName R22
SYMATTR Value {ropsb}
SYMBOL res 1360 240 R90
WINDOW 0 0 56 VBottom 2
WINDOW 3 32 56 VTop 2
SYMATTR InstName R23
SYMATTR Value {ropsb}
SYMBOL res -1072 336 R0
SYMATTR InstName R39
SYMATTR Value 60m
SYMBOL ind 752 -592 R270
WINDOW 0 32 56 VTop 2
WINDOW 3 5 56 VBottom 2
SYMATTR InstName L1
SYMATTR Value 100n
SYMATTR SpiceLine Rser=40m
SYMBOL ind 752 368 R270
WINDOW 0 32 56 VTop 2
WINDOW 3 5 56 VBottom 2
SYMATTR InstName L3
SYMATTR Value 100n
SYMATTR SpiceLine Rser=40m
SYMBOL res -1168 336 R0
SYMATTR InstName R29
SYMATTR Value 60m
SYMBOL polcap 1136 -304 R0
SYMATTR InstName C35
SYMATTR Value 47µ
SYMATTR SpiceLine V=100 Irms=250m Rser=0.171 Lser=2n Rpar=2meg Cpar=2p
SYMATTR Description Capacitor
SYMATTR Type cap
SYMBOL npn 512 496 R0
SYMATTR InstName Q6
SYMATTR Value 2SC3503F
SYMBOL res -192 -624 R90
WINDOW 0 0 56 VBottom 2
WINDOW 3 32 56 VTop 2
SYMATTR InstName R58
SYMATTR Value 510
SYMBOL ind 752 -1072 R270
WINDOW 0 32 56 VTop 2
WINDOW 3 5 56 VBottom 2
SYMATTR InstName L13
SYMATTR Value 100n
SYMATTR SpiceLine Rser=40m
SYMBOL ind 768 848 R270
WINDOW 0 32 56 VTop 2
WINDOW 3 5 56 VBottom 2
SYMATTR InstName L14
SYMATTR Value 100n
SYMATTR SpiceLine Rser=40m
SYMBOL ind 2288 848 R270
WINDOW 0 32 56 VTop 2
WINDOW 3 5 56 VBottom 2
SYMATTR InstName L20
SYMATTR Value 20n
SYMATTR SpiceLine Rser=3m
SYMBOL ind 2000 -1072 R270
WINDOW 0 32 56 VTop 2
WINDOW 3 5 56 VBottom 2
SYMATTR InstName L22
SYMATTR Value 40n
SYMATTR SpiceLine Rser=4m
SYMBOL res -208 -32 R0
SYMATTR InstName R10
SYMATTR Value {rltpdeg}
SYMBOL ind 1648 -1456 R270
WINDOW 0 32 56 VTop 2
WINDOW 3 5 56 VBottom 2
SYMATTR InstName L2
SYMATTR Value 100n
SYMATTR SpiceLine Rser=40m
SYMBOL polcap 1808 528 R90
WINDOW 0 0 32 VBottom 2
WINDOW 3 32 32 VTop 2
SYMATTR InstName C19
SYMATTR Value 2m2
SYMATTR SpiceLine V=63 Irms=2.77 Rser=0.136 Lser=14n Rpar=900k Cpar=3p
SYMATTR Description Capacitor
SYMATTR Type cap
SYMBOL polcap 1808 624 R90
WINDOW 0 0 32 VBottom 2
WINDOW 3 32 32 VTop 2
SYMATTR InstName C21
SYMATTR Value 2m2
SYMATTR SpiceLine V=63 Irms=2.77 Rser=0.136 Lser=14n Rpar=900k Cpar=3p
SYMATTR Description Capacitor
SYMATTR Type cap
SYMBOL polcap 1808 720 R90
WINDOW 0 0 32 VBottom 2
WINDOW 3 32 32 VTop 2
SYMATTR InstName C23
SYMATTR Value 2m2
SYMATTR SpiceLine V=63 Irms=2.77 Rser=0.136 Lser=14n Rpar=900k Cpar=3p
SYMATTR Description Capacitor
SYMATTR Type cap
SYMBOL polcap 1136 -912 R90
WINDOW 0 0 32 VBottom 2
WINDOW 3 32 32 VTop 2
SYMATTR InstName C25
SYMATTR Value 2m2
SYMATTR SpiceLine V=63 Irms=2.77 Rser=0.106 Lser=14n Rpar=900k Cpar=3p
SYMATTR Description Capacitor
SYMATTR Type cap
SYMBOL polcap 1744 -880 R270
WINDOW 0 32 32 VTop 2
WINDOW 3 0 32 VBottom 2
SYMATTR InstName C20
SYMATTR Value 2m2
SYMATTR SpiceLine V=63 Irms=2.77 Rser=0.106 Lser=14n Rpar=900k Cpar=3p
SYMATTR Description Capacitor
SYMATTR Type cap
SYMBOL polcap 1744 -976 R270
WINDOW 0 32 32 VTop 2
WINDOW 3 0 32 VBottom 2
SYMATTR InstName C28
SYMATTR Value 2m2
SYMATTR SpiceLine V=63 Irms=2.77 Rser=0.106 Lser=14n Rpar=900k Cpar=3p
SYMATTR Description Capacitor
SYMATTR Type cap
SYMBOL voltage -1056 -240 R0
WINDOW 3 24 96 Invisible 2
WINDOW 123 0 0 Left 2
WINDOW 39 0 0 Left 2
SYMATTR Value SINE(0 {vinput/3} 3.5k 0 0)
SYMATTR InstName V5
SYMBOL npn -448 -464 R0
SYMATTR InstName Q19
SYMATTR Value CA_BC550C
SYMBOL res -400 -336 R0
SYMATTR InstName R61
SYMATTR Value {rltpdeg}
SYMBOL res -208 -336 R0
SYMATTR InstName R62
SYMATTR Value {rltpdeg}
SYMBOL npn -128 -464 M0
SYMATTR InstName Q20
SYMATTR Value CA_BC550C
SYMBOL pnp -320 400 R180
SYMATTR InstName Q22
SYMATTR Value 2SA1381F
SYMBOL res -192 336 R90
WINDOW 0 0 56 VBottom 2
WINDOW 3 32 56 VTop 2
SYMATTR InstName R7
SYMATTR Value 510
SYMBOL npn -320 -656 M0
SYMATTR InstName Q23
SYMATTR Value 2SC3503F
SYMBOL zener 80 -432 M180
WINDOW 0 24 64 Left 2
WINDOW 3 24 0 Left 2
SYMATTR InstName D15
SYMATTR Value BZX84B20VL
SYMATTR Description Diode
SYMATTR Type diode
SYMBOL res -16 -336 R0
SYMATTR InstName R35
SYMATTR Value 4k7
SYMBOL res -16 -32 R0
SYMATTR InstName R50
SYMATTR Value 4k7
SYMBOL res -400 720 R0
SYMATTR InstName R2
SYMATTR Value 1k
SYMBOL res -400 -1088 R0
SYMATTR InstName R3
SYMATTR Value 1k
SYMBOL res 560 -1088 R0
SYMATTR InstName R6
SYMATTR Value {rvasel}
SYMBOL res -208 -1088 R0
SYMATTR InstName R36
SYMATTR Value 2k2
SYMBOL res -208 720 R0
SYMATTR InstName R40
SYMATTR Value 2k2
SYMBOL cap -592 -1008 M180
WINDOW 0 24 56 Left 2
WINDOW 3 24 8 Left 2
SYMATTR InstName C10
SYMATTR Value 100n
SYMATTR SpiceLine Rser=700m Lser=7n Rpar=4.4meg Cpar=1p
SYMBOL res 976 -1104 R90
WINDOW 0 0 56 VBottom 2
WINDOW 3 32 56 VTop 2
SYMATTR InstName R4
SYMATTR Value 22
SYMBOL res 976 816 R90
WINDOW 0 0 56 VBottom 2
WINDOW 3 32 56 VTop 2
SYMATTR InstName R47
SYMATTR Value 22
SYMBOL cap 368 -688 R0
SYMATTR InstName C4
SYMATTR Value 33p
SYMBOL cap 368 368 R0
SYMATTR InstName C22
SYMATTR Value 33p
SYMBOL zener 80 240 M180
WINDOW 0 24 64 Left 2
WINDOW 3 24 0 Left 2
SYMATTR InstName D1
SYMATTR Value BZX84B20VL
SYMATTR Description Diode
SYMATTR Type diode
SYMBOL res 560 720 R0
SYMATTR InstName R16
SYMATTR Value {rvasel}
SYMBOL nmos 1392 -592 R0
SYMATTR InstName M1
SYMATTR Value IRFP240C
SYMBOL nmos 1488 -496 R0
SYMATTR InstName M2
SYMATTR Value IRFP240C
SYMBOL pmos 1488 240 M180
SYMATTR InstName M3
SYMATTR Value IRFP9240C
SYMBOL pmos 1392 336 M180
SYMATTR InstName M4
SYMATTR Value IRFP9240C
SYMBOL npn 992 16 R0
SYMATTR InstName Q1
SYMATTR Value MJE340
SYMBOL res 848 -32 R0
SYMATTR InstName R13
SYMATTR Value 1k
SYMBOL res 848 160 R0
SYMATTR InstName R25
SYMATTR Value 1k
SYMBOL cap 176 -432 M180
WINDOW 0 24 56 Left 2
WINDOW 3 24 8 Left 2
SYMATTR InstName C16
SYMATTR Value 100n
SYMATTR SpiceLine Rser=700m Lser=7n Rpar=4.4meg Cpar=1p
SYMBOL cap 176 240 M180
WINDOW 0 24 56 Left 2
WINDOW 3 24 8 Left 2
SYMATTR InstName C29
SYMATTR Value 100n
SYMATTR SpiceLine Rser=700m Lser=7n Rpar=4.4meg Cpar=1p
SYMBOL polcap 272 176 R0
SYMATTR InstName C15
SYMATTR Value 470µ
SYMATTR SpiceLine V=63 Irms=2.77 Rser=0.036 Lser=14n Rpar=900k Cpar=3p
SYMATTR Description Capacitor
SYMATTR Type cap
SYMBOL polcap 272 -496 R0
SYMATTR InstName C9
SYMATTR Value 470µ
SYMATTR SpiceLine V=63 Irms=2.77 Rser=0.036 Lser=14n Rpar=900k Cpar=3p
SYMATTR Description Capacitor
SYMATTR Type cap
SYMBOL polcap -496 656 R0
SYMATTR InstName C1
SYMATTR Value 2m2
SYMATTR SpiceLine V=63 Irms=2.77 Rser=0.106 Lser=14n Rpar=900k Cpar=3p
SYMATTR Description Capacitor
SYMATTR Type cap
SYMBOL npn 992 -176 R0
SYMATTR InstName Q2
SYMATTR Value MJE340
SYMBOL polcap 1360 -1488 R90
WINDOW 0 0 32 VBottom 2
WINDOW 3 32 32 VTop 2
SYMATTR InstName C2
SYMATTR Value 2m2
SYMATTR SpiceLine V=63 Irms=2.77 Rser=0.106 Lser=14n Rpar=900k Cpar=3p
SYMATTR Description Capacitor
SYMATTR Type cap
SYMBOL polcap -784 -144 R90
WINDOW 0 0 32 VBottom 2
WINDOW 3 32 32 VTop 2
SYMATTR InstName C3
SYMATTR Value 2m2
SYMATTR SpiceLine V=63 Irms=2.77 Rser=0.106 Lser=14n Rpar=900k Cpar=3p
SYMATTR Description Capacitor
SYMATTR Type cap
SYMBOL npn 448 688 M0
SYMATTR InstName Q3
SYMATTR Value CA_BC550C
SYMBOL res 560 624 R0
SYMATTR InstName R24
SYMATTR Value {rvaseh}
SYMBOL res 560 -992 R0
SYMATTR InstName R11
SYMATTR Value {rvaseh}
SYMBOL pnp 448 -944 R180
WINDOW 0 77 84 Left 2
WINDOW 3 75 52 Left 2
SYMATTR InstName Q4
SYMATTR Value CA_BC560C
SYMBOL ind -1168 416 R0
SYMATTR InstName L5
SYMATTR Value 40n
SYMBOL ind -1072 416 R0
SYMATTR InstName L6
SYMATTR Value 40n
TEXT 144 -1488 Left 2 ;.op
TEXT -560 -1344 Left 2 !.option plotwinsize=0
TEXT -560 -1312 Left 2 !.option noopiter
TEXT -560 -1616 Left 2 ;Transient
TEXT -560 -1456 Left 2 !.four {freq} 10 10 v(SPK+,SPK-)
TEXT 144 -1520 Left 2 !.param prb=0
TEXT -560 -1520 Left 2 !.param timestep {1/((262144/8)*freq)}
TEXT -560 -1552 Left 2 !.param freq=1k
TEXT -560 -1488 Left 2 !.param stoptime {iterations/freq}
TEXT 144 -1584 Left 2 ;.ac oct 100 10 200meg
TEXT 144 -1552 Left 2 ;.step param prb list -1 1
TEXT 144 -1616 Left 2 ;AC analysis
TEXT -560 -1424 Left 2 !.param iterations=80
TEXT -224 -1280 Left 2 !.lib ../lib/ONNN_BJT.lib
TEXT 152 -1280 Left 2 !.param Zimp=6
TEXT 2144 -1216 Left 2 !.param Zreal Zimp/2
TEXT 2144 -1184 Left 2 !.param Zimg (Zimp*sqrt(3))/(4*pi*freq)
TEXT 152 -1248 Left 2 !.param supplyPWR=200
TEXT 152 -1216 Left 2 !.param supplyVLT=38
TEXT -224 -1216 Left 2 !.lib ../lib/STM_D.lib
TEXT -224 -1312 Left 2 !.lib ../lib/FCS_BJT.lib
TEXT 152 -1312 Left 2 !.param voutput=30
TEXT 152 -1184 Left 2 !.param supplyK=0.05
TEXT 2832 304 Left 2 !.param rser {(supplyVLT*supplyVLT*supplyK)/supplyPWR}
TEXT -560 -1584 Left 2 !.tran 0 {stoptime} 0 {timestep}
TEXT 2832 336 Left 2 !.param phi 90
TEXT 504 -1312 Left 2 !.param con1_len=15
TEXT 2832 272 Left 2 !KCON1 LVCC LPWRGND1 LVEE 0.8
TEXT 504 -1280 Left 2 !.param con2_len 10
TEXT 2144 -1248 Left 2 !KCON2 LSPKP LSPKN2 0.8
TEXT 2128 -1616 Left 2 ;Konektor zvucnika i zvucnik
TEXT 2800 -1616 Left 2 ;Konektor napajanja, star ground i napajanje
TEXT 1200 -1616 Left 2 ;Negativna povratna sprega
TEXT 152 -1344 Left 2 ;Ulazni parametri kola
TEXT 992 -1616 Center 2 ;AC sonda
TEXT -224 -1344 Left 2 !.lib ../lib/FCS_D.lib
TEXT 504 -1248 Left 2 !.param BIAS=.54
TEXT -224 -1248 Left 2 !.lib ../lib/ONNN_D.lib
TEXT 1744 -1176 Left 2 !.param knfb=20n
TEXT 1200 -1176 Left 2 !.param vinput voutput*(nfb1/nfb2)
TEXT 504 -1216 Left 2 !.param nfb1=180
TEXT 504 -1184 Left 2 !.param nfb2=2k7
TEXT -224 -1184 Left 2 !.lib ../lib/TSE_BJT.lib
TEXT -544 -1192 Left 2 !.lib ../lib/TXN_IC.lib
TEXT 2088 -496 Left 2 !.param ropsb=180
TEXT -456 -128 Left 2 !.param rltpdeg=180
TEXT 168 -952 Left 2 !.param rvasel=30
TEXT 2752 520 Left 2 !* IRFP240C VDMOS   copyright Cordell Audio December 6, 2010\n.model irfp240C VDMOS(nchan Vto=4.0 Kp=4.8 Lambda=0.0032 Rs=0.01 Rd=0.1 Rds=1e7 Cgdmax=2600p Cgdmin=10p a=0.35 Cgs=1250p Cjo=3000p m=0.75 VJ=2.5 IS=4.0E-06 N=2.4)\n*\n*\n* IRFP9240C VDMOS   copyright Cordell Audio December 6, 2010\n.model irfp9240C VDMOS(pchan Vto=-3.76 Kp=9 Lambda=0.004 Rs=0.064 Rd=0.1 Rds=1e7 Cgdmax=1200p Cgdmin=15p a=0.26 Cgs=1130p Cjo=2070p m=0.68 VJ=2.5 IS=4.0E-06 N=2.4)
TEXT 168 -920 Left 2 !.param rvaseh=100
RECTANGLE Normal 96 -1632 -576 -1392
RECTANGLE Normal 96 -1152 -576 -1360
RECTANGLE Normal 800 -1632 128 -1392
RECTANGLE Normal 2720 -1152 2112 -1632 2
RECTANGLE Normal 1120 -1152 864 -1632 2
RECTANGLE Normal 3168 -816 2928 -1584 2
RECTANGLE Normal 2048 -1152 1184 -1632 2
RECTANGLE Normal 800 -1152 128 -1360
RECTANGLE Normal 3872 384 2784 -1632 2

The netlist it stands for:
* pab3bbb-impulse.asc
R12 nfb N004 {nfb1}
V2 N040 N014 SINE(0 {supplyVLT*sqrt(2)} 50 1m 0 {phi}) Rser={rser}
Ii xp x 0 AC {u(prb)}
Vi x AC2 0 AC {u(-prb)}
Q11 N057 N026 N049 0 CA_BC560C
R33 N038 N026 {nfb1}
R34 N026 sgnd {nfb2}
R9 N032 N049 {rltpdeg}
D7 out vcc+ 1N5404
D8 vcc- out 1N5404
LTRF out speaker 5µ Rser=50m Rpar=3meg Cpar=1p
R19 out speaker 10
R20 N005 nfb {nfb2}
V1 x AC1 0
D6 N040 N003 GBPC3502
D9 N013 N036 GBPC3502
V3 N014 N036 SINE(0 {supplyVLT*sqrt(2)} 50 1m 0 {phi}) Rser={rser}
R54 out N044 10
R60 SPK+ N006 {Zreal}
L19 N006 SPK- {Zimg} Cpar=10p
V18 xp 0 0
Q17 N063 N061 N053 0 2SA1837
Q18 N011 N022 N023 0 2SC4793
R27 N022 N021 22
R30 N061 N052 22
C24 N044 pwrgnd 100n Rser=700m Lser=7n Rpar=4.4meg Cpar=1p
R§PBIAS1 N030 N039 {1+(1000*BIAS)}
R52 N020 N030 3k9
R53 N021 N020 15
D10 N036 N003 GBPC3502
D11 N013 N040 GBPC3502
LVCC vcc+ N002 {con1_len*10n} Rser={con1_len*1m + 25m}
LVEE vcc- N013 {con1_len*10n} Rser={con1_len*1m + 25m}
V11 sinus sgnd SINE(0 {vinput} {freq})
R1 N023 N053 470
Q7 N059 nfb N050 0 CA_BC560C
Q21 N021 N030 N033 0 MJE340
R18 N003 N002 25m
L4 N008 N014 4n Rser=1m
LSPKP speaker N001 {con2_len*20n} Rser={con2_len*.5m}
LSPKN2 0 N007 {con2_len*20n} Rser={con2_len*.5m}
R41 SPK+ N001 15m
R43 SPK- N007 15m
LPWRGND1 pwrgnd N008 {con1_len*10n} Rser={con1_len*1m + 25m}
V7 N041 sgnd PULSE(0 {vinput/2} 1u 1n 1n {1/(freq*2)} {1/freq})
V8 impulse N041 PULSE(0 {-vinput/2} {1u+(1/(freq*2))} 1n 1n {1/(freq*2)} {1/freq})
C17 pwrgnd N063 2m2 V=63 Irms=2.77 Rser=0.136 Lser=14n Rpar=900k Cpar=3p
R37 N039 N043 220
V4 preout AC1 0
V6 out AC2 0
V9 N042 sgnd SINE(0 {vinput/3} 19k)
V10 N037 N042 SINE(0 {vinput/3} 20k 0 0)
R5 N024 N023 {ropsb}
R14 N034 preout 0.22
R21 preout N055 0.22
C26 N046 N014 470n Rser=70m Lser=17n Rpar=4.4meg Cpar=1p
C30 N014 N013 10m V=63 Irms=2.5 Rser=0.08 Lser=20n Rpar=40k Cpar=3p
C6 N003 N014 10m V=50 Irms=2.5 Rser=0.08 Lser=20n Rpar=40k Cpar=3p
R42 N014 N013 10k
R46 N003 N014 10k
C32 N009 pgnd 2m2 V=63 Irms=2.77 Rser=0.106 Lser=14n Rpar=900k Cpar=3p
R48 sinus sgnd 100k
R49 sgnd pgnd 10
D4 N004 sgnd 1N4148
D5 sgnd N004 1N4148
R8 N035 preout 0.22
R15 preout N051 0.22
Q15 N019 N016 N015 0 2SA1381F
C5 N011 pwrgnd 100n Rser=700m Lser=7n Rpar=4.4meg Cpar=1p
C27 N063 pwrgnd 100n Rser=700m Lser=7n Rpar=4.4meg Cpar=1p
R28 N046 N036 1
C7 N047 N040 470n Rser=70m Lser=17n Rpar=4.4meg Cpar=1p
R26 N047 N014 1
C12 N066 pgnd 100n Rser=700m Lser=7n Rpar=4.4meg Cpar=1p
R31 speaker N045 10
C13 N045 0 100n Rser=700m Lser=7n Rpar=4.4meg Cpar=1p
R17 N027 N023 {ropsb}
R22 N054 N053 {ropsb}
R23 N056 N053 {ropsb}
R39 pwrgnd P001 60m
L1 N019 N020 100n Rser=40m
L3 N060 N052 100n Rser=40m
R29 pwrgnd P002 60m
C35 N021 N052 47µ V=100 Irms=250m Rser=0.171 Lser=2n Rpar=2meg Cpar=2p
Q6 N060 N062 N064 0 2SC3503F
R58 N018 N017 510
L13 N009 N010 100n Rser=40m
L14 N066 N067 100n Rser=40m
L20 N063 vcc- 20n Rser=3m
L22 N011 vcc+ 40n Rser=4m
R10 N032 N050 {rltpdeg}
L2 N005 out 100n Rser=40m
C19 pwrgnd N063 2m2 V=63 Irms=2.77 Rser=0.136 Lser=14n Rpar=900k Cpar=3p
C21 pwrgnd N063 2m2 V=63 Irms=2.77 Rser=0.136 Lser=14n Rpar=900k Cpar=3p
C23 pwrgnd N063 2m2 V=63 Irms=2.77 Rser=0.136 Lser=14n Rpar=900k Cpar=3p
C25 N011 pwrgnd 2m2 V=63 Irms=2.77 Rser=0.106 Lser=14n Rpar=900k Cpar=3p
C20 N011 pwrgnd 2m2 V=63 Irms=2.77 Rser=0.106 Lser=14n Rpar=900k Cpar=3p
C28 N011 pwrgnd 2m2 V=63 Irms=2.77 Rser=0.106 Lser=14n Rpar=900k Cpar=3p
V5 imd N037 SINE(0 {vinput/3} 3.5k 0 0)
Q19 N025 N026 N028 0 CA_BC550C
R61 N028 N031 {rltpdeg}
R62 N029 N031 {rltpdeg}
Q20 N018 nfb N029 0 CA_BC550C
Q22 N062 N058 N057 0 2SA1381F
R7 N059 N058 510
Q23 N016 N017 N025 0 2SC3503F
D15 pgnd N018 BZX84B20VL
R35 N018 N032 4k7
R50 N031 N059 4k7
R2 N062 N066 1k
R3 N009 N016 1k
R6 N009 N012 {rvasel}
R36 N009 N018 2k2
R40 N059 N066 2k2
C10 pgnd N009 100n Rser=700m Lser=7n Rpar=4.4meg Cpar=1p
R4 N011 N010 22
R47 N063 N067 22
C4 N016 N019 33p
C22 N060 N062 33p
D1 N059 pgnd BZX84B20VL
R16 N065 N066 {rvasel}
M1 N011 N024 N034 N034 IRFP240C
M2 N011 N027 N035 N035 IRFP240C
M3 N063 N054 N051 N051 IRFP9240C
M4 N063 N056 N055 N055 IRFP9240C
Q1 N043 N048 N052 0 MJE340
R13 N043 N048 1k
R25 N048 N052 1k
C16 pgnd N018 100n Rser=700m Lser=7n Rpar=4.4meg Cpar=1p
C29 N059 pgnd 100n Rser=700m Lser=7n Rpar=4.4meg Cpar=1p
C15 pgnd N059 470µ V=63 Irms=2.77 Rser=0.036 Lser=14n Rpar=900k Cpar=3p
C9 N018 pgnd 470µ V=63 Irms=2.77 Rser=0.036 Lser=14n Rpar=900k Cpar=3p
C1 pgnd N066 2m2 V=63 Irms=2.77 Rser=0.106 Lser=14n Rpar=900k Cpar=3p
Q2 N033 N033 N043 0 MJE340
C2 N004 sgnd 2m2 V=63 Irms=2.77 Rser=0.106 Lser=14n Rpar=900k Cpar=3p
C3 N038 sinus 2m2 V=63 Irms=2.77 Rser=0.106 Lser=14n Rpar=900k Cpar=3p
Q3 N062 N065 N066 0 CA_BC550C
R24 N064 N065 {rvaseh}
R11 N012 N015 {rvaseh}
Q4 N016 N012 N009 0 CA_BC560C
L5 P002 0 40n
L6 P001 pgnd 40n
.model D D
.lib standard.dio
.model NPN NPN
.model PNP PNP
.lib standard.bjt
.model NMOS NMOS
.model PMOS PMOS
.lib standard.mos
* .op
.option plotwinsize=0
.option noopiter
* Transient
.four {freq} 10 10 v(SPK+,SPK-)
.param prb=0
.param timestep {1/((262144/8)*freq)}
.param freq=1k
.param stoptime {iterations/freq}
* .ac oct 100 10 200meg
* .step param prb list -1 1
* AC analysis
.param iterations=80
.lib ../lib/ONNN_BJT.lib
.param Zimp=6
.param Zreal Zimp/2
.param Zimg (Zimp*sqrt(3))/(4*pi*freq)
.param supplyPWR=200
.param supplyVLT=38
.lib ../lib/STM_D.lib
.lib ../lib/FCS_BJT.lib
.param voutput=30
.param supplyK=0.05
.param rser {(supplyVLT*supplyVLT*supplyK)/supplyPWR}
.tran 0 {stoptime} 0 {timestep}
.param phi 90
.param con1_len=15
KCON1 LVCC LPWRGND1 LVEE 0.8
.param con2_len 10
KCON2 LSPKP LSPKN2 0.8
* Konektor zvucnika i zvucnik
* Konektor napajanja, star ground i napajanje
* Negativna povratna sprega
* Ulazni parametri kola
* AC sonda
.lib ../lib/FCS_D.lib
.param BIAS=.54
.lib ../lib/ONNN_D.lib
.param knfb=20n
.param vinput voutput*(nfb1/nfb2)
.param nfb1=180
.param nfb2=2k7
.lib ../lib/TSE_BJT.lib
.lib ../lib/TXN_IC.lib
.param ropsb=180
.param rltpdeg=180
.param rvasel=30
* IRFP240C VDMOS   copyright Cordell Audio December 6, 2010
.model irfp240C VDMOS(nchan Vto=4.0 Kp=4.8 Lambda=0.0032 Rs=0.01 Rd=0.1 Rds=1e7 Cgdmax=2600p Cgdmin=10p a=0.35 Cgs=1250p Cjo=3000p m=0.75 VJ=2.5 IS=4.0E-06 N=2.4)
*
*
* IRFP9240C VDMOS   copyright Cordell Audio December 6, 2010
.model irfp9240C VDMOS(pchan Vto=-3.76 Kp=9 Lambda=0.004 Rs=0.064 Rd=0.1 Rds=1e7 Cgdmax=1200p Cgdmin=15p a=0.26 Cgs=1130p Cjo=2070p m=0.68 VJ=2.5 IS=4.0E-06 N=2.4)
.param rvaseh=100
.backanno
.end